# Altium schematic sheet Akustikk_forsterkerkrets.SchDoc: AAC9000
size A3; Author: Vegard Haraldstad; CompanyName: VORTEX NTNU; DrawnBy: Vegard Haraldstad; Revision: 1.0; SheetNumber: 1; SheetTotal: 1
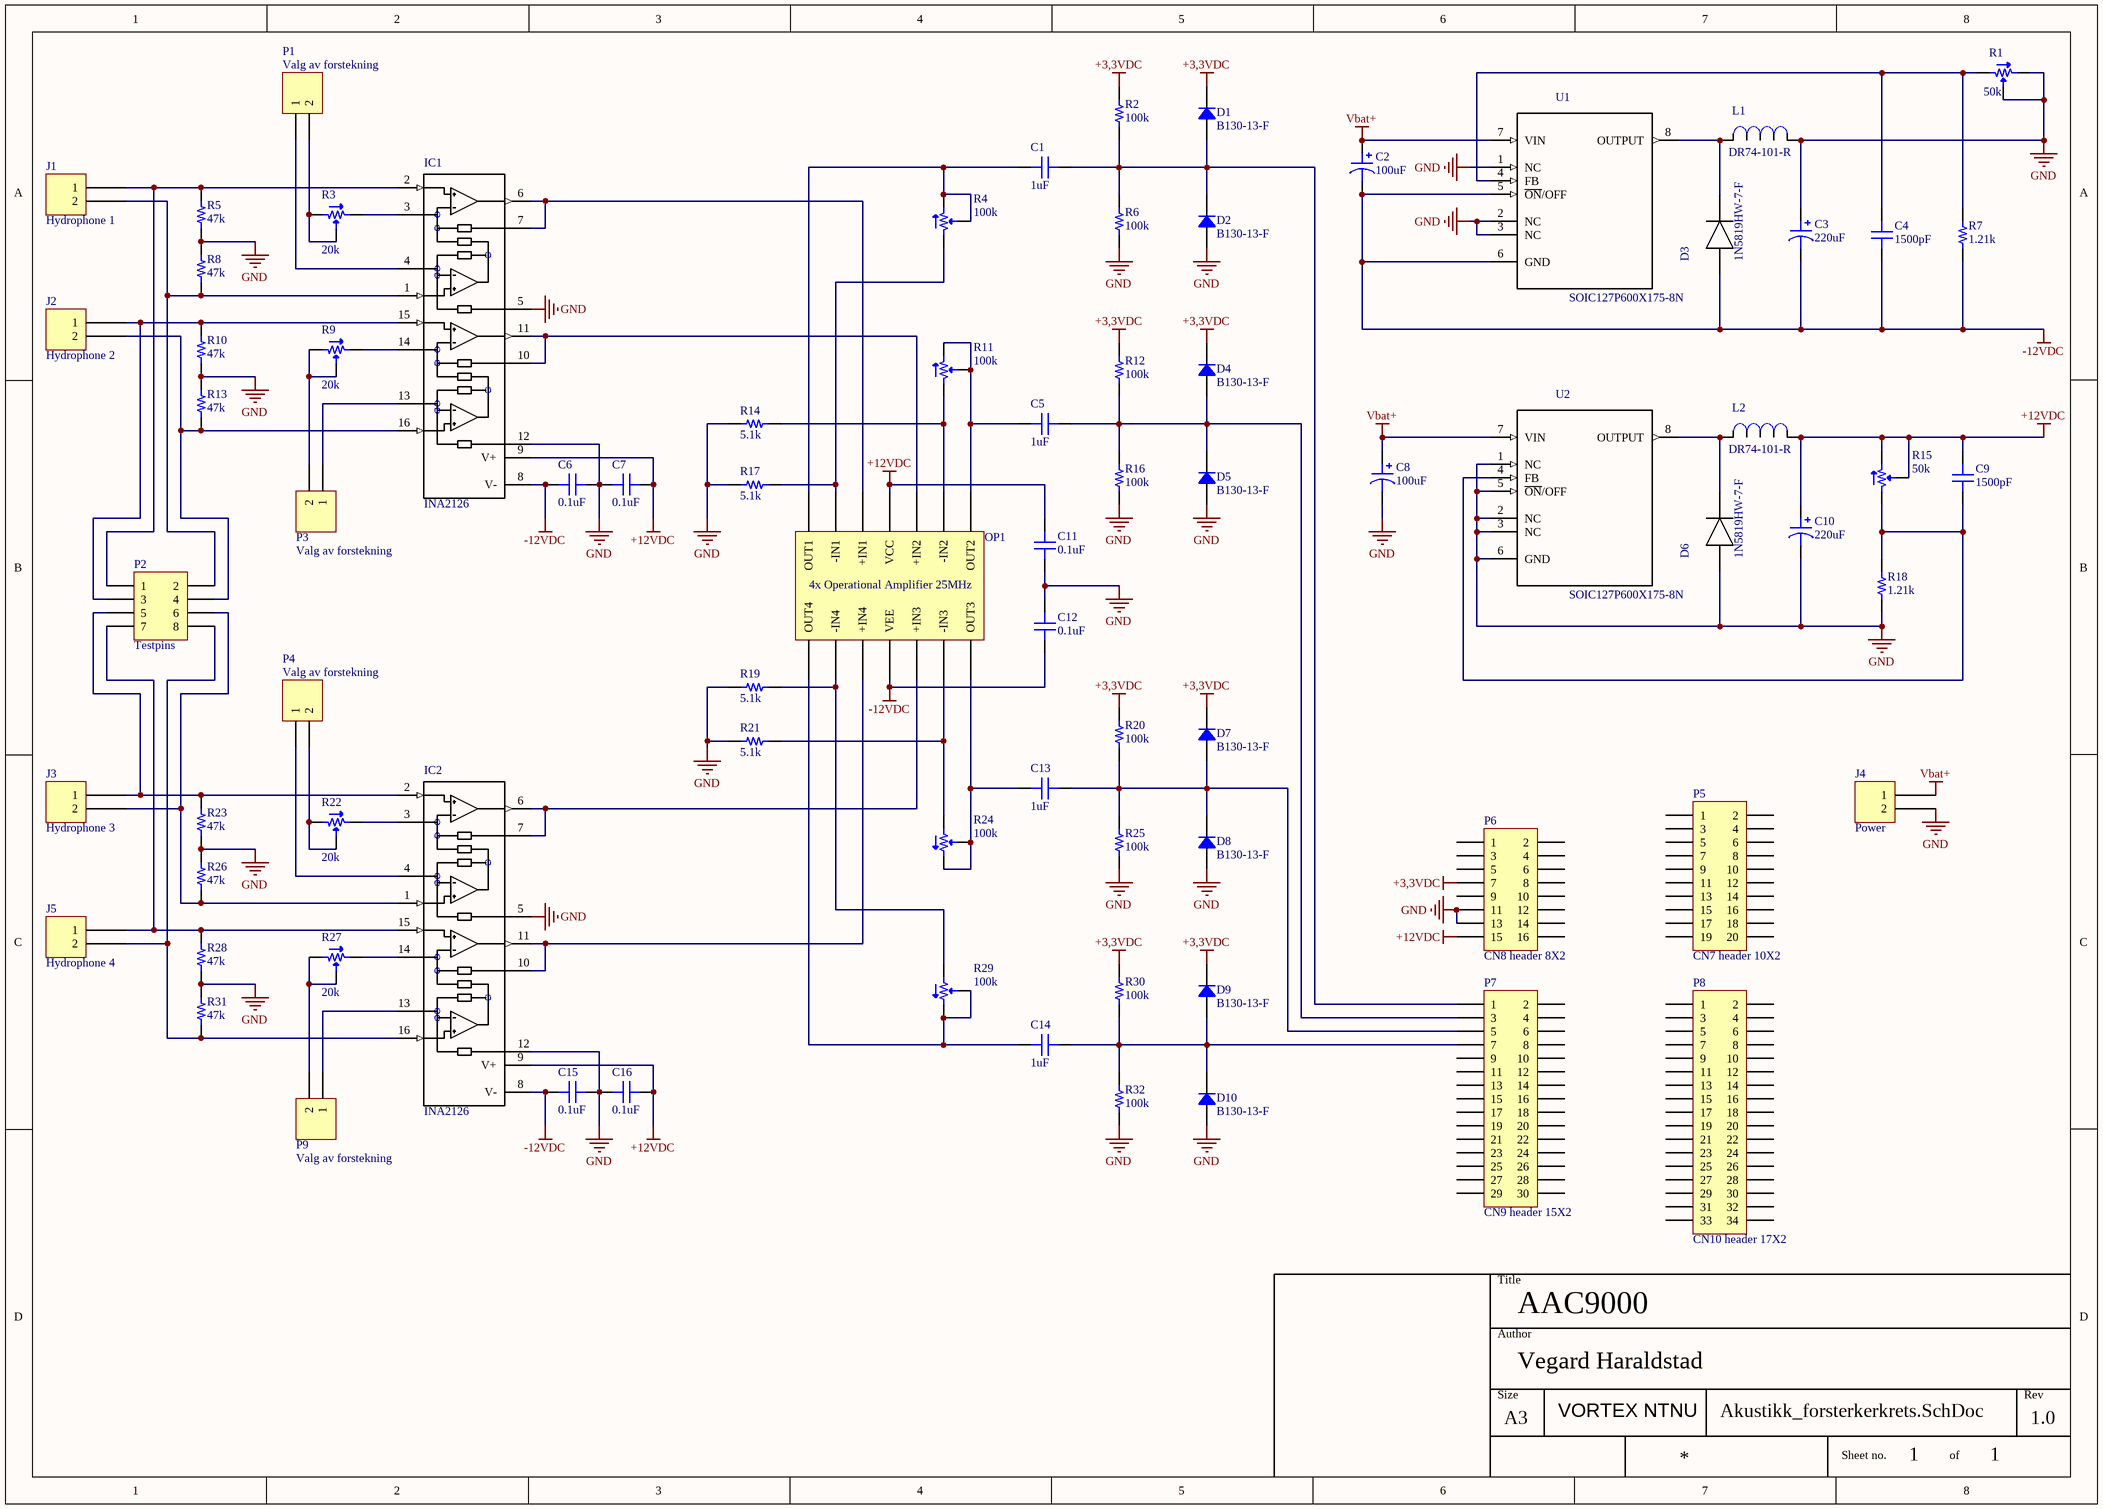
[diagram p0: Akustikk_forsterkerkrets.SchDoc]

## Parts
C1  1uF  [CAP 0805/2012]
C2  100uF  [CAP ALUM 10.3MM]
C3  220uF  [CAP ALUM 6.6MM]
C4  1500pF  [CAP 0805/2012]
C5  1uF  [CAP 0805/2012]
C6  0.1uF  [CAP 0805/2012]
C7  0.1uF  [CAP 0805/2012]
C8  100uF  [CAP ALUM 10.3MM]
C9  1500pF  [CAP 0805/2012]
C10  220uF  [CAP ALUM 6.6MM]
C11  0.1uF  [CAP 0805/2012]
C12  0.1uF  [CAP 0805/2012]
C13  1uF  [CAP 0805/2012]
C14  1uF  [CAP 0805/2012]
C15  0.1uF  [CAP 0805/2012]
C16  0.1uF  [CAP 0805/2012]
D1  B130-13-F  [DO214AC SMA]
D2  B130-13-F  [DO214AC SMA]
D3  1N5819HW-7-F  [1N5819HW-7-F]
D4  B130-13-F  [DO214AC SMA]
D5  B130-13-F  [DO214AC SMA]
D6  1N5819HW-7-F  [1N5819HW-7-F]
D7  B130-13-F  [DO214AC SMA]
D8  B130-13-F  [DO214AC SMA]
D9  B130-13-F  [DO214AC SMA]
D10  B130-13-F  [DO214AC SMA]
IC1  INA2126  [SOP63P600X175-16N]
IC2  INA2126  [SOP63P600X175-16N]
J1  Hydrophone 1  [JST XH B2B-XH-A]
J2  Hydrophone 2  [JST XH B2B-XH-A]
J3  Hydrophone 3  [JST XH B2B-XH-A]
J4  Power  [JST XH B2B-XH-A]
J5  Hydrophone 4  [JST XH B2B-XH-A]
L1  DR74-101-R  [DR74-101-R]
L2  DR74-101-R  [DR74-101-R]
OP1  4x Operational Amplifier 25MHz  [SOIC127P600X175-14N]
P1  Valg av forstekning  [HDR1X2]
P2  Testpins  [HDR2X4]
P3  Valg av forstekning  [HDR1X2]
P4  Valg av forstekning  [HDR1X2]
P5  CN7 header 10X2  [HDR2X10]
P6  CN8 header 8X2  [HDR2X8]
P7  CN9 header 15X2  [HDR2X15]
P8  CN10 header 17X2  [HDR2X17]
P9  Valg av forstekning  [HDR1X2]
R1  50k  [POT BOURNS TRIMPOT 3302]
R2  100k  [RES 0805/2012]
R3  20k  [POT BOURNS TRIMPOT 3302]
R4  100k  [POT BOURNS TRIMPOT 3302]
R5  47k  [RES 0805/2012]
R6  100k  [RES 0805/2012]
R7  1.21k  [RES 0805/2012]
R8  47k  [RES 0805/2012]
R9  20k  [POT BOURNS TRIMPOT 3302]
R10  47k  [RES 0805/2012]
R11  100k  [POT BOURNS TRIMPOT 3302]
R12  100k  [RES 0805/2012]
R13  47k  [RES 0805/2012]
R14  5.1k  [RES 0805/2012]
R15  50k  [POT BOURNS TRIMPOT 3302]
R16  100k  [RES 0805/2012]
R17  5.1k  [RES 0805/2012]
R18  1.21k  [RES 0805/2012]
R19  5.1k  [RES 0805/2012]
R20  100k  [RES 0805/2012]
R21  5.1k  [RES 0805/2012]
R22  20k  [POT BOURNS TRIMPOT 3302]
R23  47k  [RES 0805/2012]
R24  100k  [POT BOURNS TRIMPOT 3302]
R25  100k  [RES 0805/2012]
R26  47k  [RES 0805/2012]
R27  20k  [POT BOURNS TRIMPOT 3302]
R28  47k  [RES 0805/2012]
R29  100k  [POT BOURNS TRIMPOT 3302]
R30  100k  [RES 0805/2012]
R31  47k  [RES 0805/2012]
R32  100k  [RES 0805/2012]
U1  SOIC127P600X175-8N  [SOIC127P600X175-8N]
U2  SOIC127P600X175-8N  [SOIC127P600X175-8N]

## Nets
+3,3VDC: D1.2 D4.2 D7.2 D9.2 P6.7 R2.2 R12.2 R20.2 R30.2
+12VDC: C7.2 C9.2 C10.1 C11.2 C16.2 IC1.9(V+) IC2.9(V+) L2.1 OP1.4(VCC) P6.15 R15.2 R15.3
-12VDC: C2.2 C3.2 C4.1 C6.1 C12.1 C15.1 D3.2(A) IC1.8(V-) IC2.8(V-) OP1.11(VEE) R7.1 U1.5(~{ON}/OFF) U1.6(GND)
GND: C3.1 C6.2 C7.1 C8.2 C10.2 C11.1 C12.2 C15.2 C16.1 D2.1 D5.1 D6.2(A) D8.1 D10.1 IC1.5(REFA) IC1.12(REFB) IC2.5(REFA) IC2.12(REFB) J4.2 L1.1 P6.11 P6.13 R1.2 R1.3 R5.1 R6.1 R8.2 R10.1 R13.2 R14.2 R16.1 R17.2 R18.1 R19.2 R21.2 R23.1 R25.1 R26.2 R28.1 R31.2 R32.1 U1.1(NC) U1.2(NC) U1.3(NC) U2.1(NC) U2.2(NC) U2.3(NC) U2.5(~{ON}/OFF) U2.6(GND)
Vbat+: C2.1 C8.1 J4.1 U1.7(VIN) U2.7(VIN)
NetC1_1: C1.1 OP1.1(OUT1) R4.2 R4.3
NetC1_2: C1.2 D1.1 D2.2 P7.1 R2.1 R6.2
NetC4_2: C4.2 R1.1 R7.2 U1.4(FB)
NetC5_1: C5.1 OP1.7(OUT2) R11.2 R11.3
NetC5_2: C5.2 D4.1 D5.2 P7.3 R12.1 R16.2
NetC9_1: C9.1 R15.1 R18.2 U2.4(FB)
NetC13_1: C13.1 OP1.14(OUT3) R24.2 R24.3
NetC13_2: C13.2 D7.1 D8.2 P7.5 R20.1 R25.2
NetC14_1: C14.1 OP1.8(OUT4) R29.2 R29.3
NetC14_2: C14.2 D9.1 D10.2 P7.7 R30.1 R32.2
NetD3_1: D3.1(C) L1.2 U1.8(OUTPUT)
NetD6_1: D6.1(C) L2.2 U2.8(OUTPUT)
NetIC1_1: IC1.1(-INA) J1.2 P2.2 R8.1
NetIC1_2: IC1.2(+INA) J1.1 P2.1 R5.2
NetIC1_3: IC1.3(RGA) R3.3
NetIC1_4: IC1.4(RGA@1) P1.1
NetIC1_6: IC1.6(OUTA) IC1.7(SENSEA) OP1.3(+IN1)
NetIC1_10: IC1.10(SENSEB) IC1.11(OUTB) OP1.5(+IN2)
NetIC1_13: IC1.13(RGB@1) P3.1
NetIC1_14: IC1.14(RGB) R9.3
NetIC1_15: IC1.15(+INB) J2.1 P2.3 R10.2
NetIC1_16: IC1.16(-INB) J2.2 P2.4 R13.1
NetIC2_1: IC2.1(-INA) J3.2 P2.6 R26.1
NetIC2_2: IC2.2(+INA) J3.1 P2.5 R23.2
NetIC2_3: IC2.3(RGA) R22.3
NetIC2_4: IC2.4(RGA@1) P4.1
NetIC2_6: IC2.6(OUTA) IC2.7(SENSEA) OP1.12(+IN3)
NetIC2_10: IC2.10(SENSEB) IC2.11(OUTB) OP1.10(+IN4)
NetIC2_13: IC2.13(RGB@1) P9.1
NetIC2_14: IC2.14(RGB) R27.3
NetIC2_15: IC2.15(+INB) J5.1 P2.7 R28.2
NetIC2_16: IC2.16(-INB) J5.2 P2.8 R31.1
NetOP1_2: OP1.2(-IN1) R4.1 R17.1
NetOP1_6: OP1.6(-IN2) R11.1 R14.1
NetOP1_9: OP1.9(-IN4) R19.1 R29.1
NetOP1_13: OP1.13(-IN3) R21.1 R24.1
NetP1_2: P1.2 R3.1 R3.2
NetP3_2: P3.2 R9.1 R9.2
NetP4_2: P4.2 R22.1 R22.2
NetP9_2: P9.2 R27.1 R27.2

Not connected (* = marked no-connect by the designer): P5 1 2 3 4 5 6 7 8 9 10 11 12 13 14 15 16 17 18 19 20; P6 1 2 3 4 5 6 8 9 10 12 14 16; P7 2 4 6 8 9 10 11 12 13 14 15 16 17 18 19 20 21 22 23 24 25 26 27 28 29 30; P8 1 2 3 4 5 6 7 8 9 10 11 12 13 14 15 16 17 18 19 20 21 22 23 24 25 26 27 28 29 30 31 32 33 34

## Notes on the sheet
- Title
- Size
- Author
- Rev
- A3
- Sheet no.
- of

## Library data of the parts
C1 C5 C13 C14 = C0805C105J3RACTU: CAP CER 1UF 25V X7R 0805; Manufacturer: Kemet; TemperatureRange: -55C ~ 125C; Tolerance: 5%; Value: 1uF; Part Number: C0805C105J3RACTU; PartId: 6145; Supplier 1: Digi-Key; Supplier Part Number 1: 399-10060-2-ND; ComponentLink1Description: Datasheet; ComponentLink1URL: http://www.kemet.com/docfinder?Partnumber=C0805C105J3RACTU; ComponentLink2Description: Digi-Key listing; ComponentLink2URL: http://digikey.com/product-detail/en/C0805C105J3RACTU/399-10060-2-ND/2211758; TemperatureCoefficient: X7R; Voltage: 25V; Price: 0,355; Type: -; Device Package: 0805 (2012 Metric)
C2 C8 = EEE-FC1H101P: CAP ALUM 100UF 20% 50V SMD; Manufacturer: Panasonic Electronic Components; TemperatureRange: -40C ~ 105C; Type: AEC-Q200; Ripple Current: 375mA; Impedance: 300 mOhm; Lifetime @ Temp: 1000 Hrs @ 105C; Value: 100uF; Part Number: EEE-FC1H101P; PartId: 7438; Supplier 1: Digi-Key; Supplier Part Number 1: PCE4013TR-ND; ComponentLink1Description: Datasheet; ComponentLink1URL: http://industrial.panasonic.com/www-cgi/jvcr13pz.cgi?E+PZ+3+ABA0005+EEEFC1H101P+7+WW; ComponentLink2Description: Digi-Key listing; ComponentLink2URL: http://digikey.com/product-detail/en/EEE-FC1H101P/PCE4013TR-ND/817422; Tolerance: 20%; Voltage: 50V; Price: 0,4156; Device Package: Radial, Can - SMD
C3 C10 = EEE-FTE221XAP: CAP ALUM 220UF 20% 25V SMD; Manufacturer: Panasonic Electronic Components; TemperatureRange: -55C ~ 105C; Type: Automotive; Ripple Current: 390mA; Lifetime @ Temp: 2000 Hrs @ 105C; Value: 220uF; Part Number: EEE-FTE221XAP; PartId: 7275; Supplier 1: Digi-Key; Supplier Part Number 1: PCE5009TR-ND; ComponentLink1Description: Datasheet; ComponentLink1URL: http://industrial.panasonic.com/lecs/www-data/pdf/ABA0000/ABA0000CE135.pdf; ComponentLink2Description: Digi-Key listing; ComponentLink2URL: http://digikey.com/product-detail/en/EEE-FTE221XAP/PCE5009TR-ND/2652040; Tolerance: 20%; Voltage: 25V; Price: 0,3668; Device Package: Radial, Can - SMD; Impedance: -
C4 C9 = C2012C0G1H152J060AA: CAP CER 1500PF 50V C0G 0805; Manufacturer: TDK Corporation; TemperatureRange: -55C ~ 125C; TemperatureCoefficient: C0G, NP0; Tolerance: 5%; Value: 1500pF; Part Number: C2012C0G1H152J060AA; PartId: 4413; Supplier 1: Digi-Key; Supplier Part Number 1: 445-1331-2-ND; ComponentLink1Description: Datasheet; ComponentLink1URL: https://product.tdk.com/info/en/catalog/datasheets/mlcc_commercial_general_en.pdf; ComponentLink2Description: Digi-Key listing; ComponentLink2URL: http://digikey.com/product-detail/en/C2012C0G1H152J060AA/445-1331-2-ND/513857; Voltage: 50V; Price: 0,0308; Type: -; Device Package: 0805 (2012 Metric)
C6 C7 C11 C12 C15 C16 = CL21B104KACNNNC: CAP CER 0.1UF 25V X7R 0805; Manufacturer: Samsung Electro-Mechanics America, Inc.; TemperatureRange: -55C ~ 125C; Tolerance: 10%; Value: 0.1uF; Part Number: CL21B104KACNNNC; PartId: 5699; Supplier 1: Digi-Key; Supplier Part Number 1: 1276-1099-2-ND; ComponentLink1Description: Datasheet; ComponentLink1URL: http://www.samsungsem.com/kr/support/product-search/mlcc/CL21B104KACNNNC.jsp; ComponentLink2Description: Digi-Key listing; ComponentLink2URL: http://digikey.com/product-detail/en/CL21B104KACNNNC/1276-1099-2-ND/3886757; TemperatureCoefficient: X7R; Voltage: 25V; Price: 0,0099; Type: -; Device Package: 0805 (2012 Metric)
D1 D2 D4 D5 D7-D10 = B130-13-F: DIODE SCHOTTKY 30V 1A SMA; Manufacturer: Diodes Incorporated; Type: Surface Mount; Current Reverse Leakage @ Vr: 500uA @ 30V; Voltage Forward (Vf): 500mV @ 1A; Part Number: B130-13-F; PartId: 7122; Supplier 1: Digi-Key; Supplier Part Number 1: B130-FDITR-ND; ComponentLink1Description: Datasheet; ComponentLink1URL: http://www.diodes.com/_files/datasheets/ds13002.pdf; ComponentLink2Description: Digi-Key Listing; ComponentLink2URL: http://www.digikey.ca/product-detail/en/B130-13-F/B130-FDITR-ND/814935; Junction Operating Temperature: -65C ~ 150C; Price: 0,0852; Device Package: DO-214AC, SMA; Reverse Recovery Time (trr): -; Voltage DC Reverse (Vr): 30V; Current Rectified: 1A
D3 D6 = 1N5819HW-7-F: 1N5819HW Series 40 V 1 A Surface Mount Schottky Barrier Rectifier - SOD-123; MF: Diodes Inc.; SnapEDA_Link: https://www.snapeda.com/parts/1N5819HW-7-F/Diodes%20Inc./view-part/?ref=snap; Digi-Key_Part_Number: 1N5819HW-FDICT-ND; Digi-Key_Purchase_URL: https://www.digikey.no/product-detail/en/diodes-incorporated/1N5819HW-7-F/1N5819HW-FDICT-ND/815283?utm_source=snapeda&utm_medium=aggregator&utm_campaign=symbol; MP: 1N5819HW-7-F; Package: SOD-123 Diodes Inc.; Value: *; Part Number: 1N5819HW-7-F; ComponentLink1Description: Manufacturer Link; ComponentLink1URL: https://www.digikey.no/en/supplier-centers/d/diodes; ComponentLink2Description: Datasheet; ComponentLink2URL: https://www.diodes.com/assets/Datasheets/ds30217.pdf; Supplier 1: Digi-Key; Supplier Part Number 1: 1N5819HW-FDICT-ND
IC1 IC2 = INA2126EA/250: the ina126 and ina2126 are precision instrumentation amplifiers for accurate low noise differential signal acquisitio...; MF: Texas Instruments; MP: INA2126; Package: None; Availability: Unavailable; Price: None; SnapEDA_Link: https://www.snapeda.com/parts/INA2126/Texas%20Instruments/view-part/?ref=snap; Value: *; Part Number: INA2126EA/250; ComponentLink1Description: Manufacturer Link; ComponentLink1URL: http://www.ti.com/; ComponentLink2Description: Datasheet; ComponentLink2URL: http://www.ti.com/lit/ds/symlink/ina126.pdf; Supplier 1: Digi-Key; Supplier Part Number 1: INA2126EACT-ND
J1-J5 = B2B-XH-A(LF)(SN): CONN HEADER XH TOP 2POS 2.5MM; Manufacturer: JST Sales America Inc.; Pitch: 0.098" (2.50mm); Number Of Positions: 2; Part Number: B2B-XH-A(LF)(SN); Colour: Natural; PartId: 16449; Supplier 1: Digi-Key; Supplier Part Number 1: 455-2247-ND; ComponentLink1Description: Datasheet; ComponentLink1URL: http://www.jst-mfg.com/product/pdf/eng/eXH.pdf; ComponentLink2Description: Digi-Key Listing; ComponentLink2URL: http://www.digikey.com/product-detail/en/jst-sales-america-inc/B2B-XH-A(LF)(SN)/455-2247-ND/1651045; Price: 0,15; Type: Header, Shrouded; Contact Finish: Tin; Fastening Type: Detent Lock; Number Of Rows: 1; Series: XH
L1 L2 = DR74-101-R: Inductor Power Shielded Drum Core 101.6uH/100uH 20% 100KHz Ferrite 860mA 383mOhm DCR T/R; MF: Eaton; Value: 100 μH; SnapEDA_Link: https://www.snapeda.com/parts/DR74-101-R/Eaton/view-part/?ref=snap; Availability: Unavailable; MP: DR74-101-R; Price: None; Package: Nonstandard Eaton; Part Number: DR74-101-R; ComponentLink1Description: Manufacturer Link; ComponentLink1URL: https://www.digikey.no/en/supplier-centers/e/eaton; ComponentLink2Description: Datasheet; ComponentLink2URL: https://www.eaton.com/content/dam/eaton/products/electronic-components/resources/data-sheet/eaton-dr-high-power-density-high-efficiency-shielded-drum-core-power-inductors-data-sheet.pdf; Supplier 1: Digi-Key; Supplier Part Number 1: 513-1225-1-ND; Irms: 860mA
OP1 = LM837MX/NOPB: Part Number: LM837MX/NOPB; ComponentLink1Description: Manufacturer Link; ComponentLink1URL: http://www.ti.com/; ComponentLink2Description: Datasheet; ComponentLink2URL: http://www.ti.com/lit/ds/symlink/lm837.pdf; Supplier 1: Digi-Key; Supplier Part Number 1: 296-43966-1-ND
P1 P3 P4 P9 = Header 2: Header, 2-Pin; LatestRevisionDate: 17-Jul-2002; LatestRevisionNote: Re-released for DXP Platform.; Publisher: Altium Limited
P2 = Header 4X2: Header, 4-Pin, Dual row; LatestRevisionDate: 17-Jul-2002; LatestRevisionNote: Re-released for DXP Platform.; Publisher: Altium Limited
P5 = Header 10X2: Header, 10-Pin, Dual row; LatestRevisionDate: 17-Jul-2002; LatestRevisionNote: Re-released for DXP Platform.; Publisher: Altium Limited
P6 = Header 8X2: Header, 8-Pin, Dual row; LatestRevisionDate: 17-Jul-2002; LatestRevisionNote: Re-released for DXP Platform.; Publisher: Altium Limited
P7 = Header 15X2: Header, 15-Pin, Dual row; LatestRevisionDate: 17-Jul-2002; LatestRevisionNote: Re-released for DXP Platform.; Publisher: Altium Limited
P8 = Header 17X2: Header, 17-Pin, Dual row; LatestRevisionDate: 17-Jul-2002; LatestRevisionNote: Re-released for DXP Platform.; Publisher: Altium Limited
R1 R3 R4 R9 R11 R15 R22 R24 R27 R29 = 3302W-3-203E: TRIMMER 20K OHM 0.15W SMD; Manufacturer: Bourns Inc.; TemperatureCoefficient: 250ppm/C; Tolerance: 25%; Number Of Turns: 1; Adjustment Type: Top Adjustment; Part Number: 3302W-3-203E; PartId: 29442; Supplier 1: Digi-Key; Supplier Part Number 1: 3302W-203ECT-ND; ComponentLink1Description: Datasheet; ComponentLink1URL: http://www.bourns.com/docs/Product-Datasheets/3302.pdf; ComponentLink2Description: Digi-Key Listing; ComponentLink2URL: https://www.digikey.com/product-detail/en/bourns-inc/3302W-3-203E/3302W-203ECT-ND/612878; PowerRating: 0.15W; Price: 0,97
  R1 R15: Value: 50k
  R3 R9 R22 R27: Value: 20k
  R4 R11 R24 R29: Value: 100k
R2 R6 R12 R16 R20 R25 R30 R32 = ERJ-6GEYJ104V: RES SMD 100K OHM 5% 1/8W 0805; Manufacturer: Panasonic Electronic Components; TemperatureRange: -55C ~ 155C; TemperatureCoefficient: 200ppm/C; PowerRating: 0.125W, 1/8W; Value: 100k; Part Number: ERJ-6GEYJ104V; PartId: 11445; Supplier 1: Digi-Key; Supplier Part Number 1: P100KATR-ND; ComponentLink1Description: Datasheet; ComponentLink1URL: http://industrial.panasonic.com/www-cgi/jvcr13pz.cgi?E+PZ+3+AOA0001+ERJ6GEYJ104V+7+WW; ComponentLink2Description: Digi-Key Listing; ComponentLink2URL: https://www.digikey.com/product-detail/en/panasonic-electronic-components/ERJ-6GEYJ104V/P100KATR-ND/83110; Tolerance: 5%; Price: 0,0032; Device Package: 0805 (2012 Metric)
R5 R8 R10 R13 R23 R26 R28 R31 = ERJ-6ENF4702V: RES SMD 47K OHM 1% 1/8W 0805; Manufacturer: Panasonic Electronic Components; TemperatureRange: -55C ~ 155C; TemperatureCoefficient: 100ppm/C; PowerRating: 0.125W, 1/8W; Value: 47k; Part Number: ERJ-6ENF4702V; PartId: 1984; Supplier 1: Digi-Key; Supplier Part Number 1: P47.0KCTR-ND; ComponentLink1Description: Datasheet; ComponentLink1URL: http://industrial.panasonic.com/www-cgi/jvcr13pz.cgi?E+PZ+3+AOA0002+ERJ6ENF4702V+7+WW; ComponentLink2Description: Digi-Key listing; ComponentLink2URL: http://digikey.com/product-detail/en/ERJ-6ENF4702V/P47.0KCTR-ND/1746509; Tolerance: 1%; Price: 0,0073; Type: Thick Film; Device Package: 0805 (2012 Metric)
R7 R18 = ERA-6AEB1211V: RES SMD 1.21K OHM 0.1% 1/8W 0805; Manufacturer: Panasonic Electronic Components; TemperatureRange: -55C ~ 155C; TemperatureCoefficient: 25ppm/C; PowerRating: 0.125W, 1/8W; Value: 1.21k; Part Number: ERA-6AEB1211V; PartId: 2672; Supplier 1: Digi-Key; Supplier Part Number 1: P1.21KDATR-ND; ComponentLink1Description: Datasheet; ComponentLink1URL: http://industrial.panasonic.com/lecs/www-data/pdf/AOA0000/AOA0000CE26.pdf; ComponentLink2Description: Digi-Key listing; ComponentLink2URL: http://digikey.com/product-detail/en/ERA-6AEB1211V/P1.21KDATR-ND/2025670; Tolerance: 0.1%; Price: 0,0653; Type: Thin Film; Device Package: 0805 (2012 Metric)
R14 R17 R19 R21 = ERJ-6ENF5101V: RES SMD 5.1K OHM 1% 1/8W 0805; Manufacturer: Panasonic Electronic Components; TemperatureRange: -55C ~ 155C; TemperatureCoefficient: 100ppm/C; PowerRating: 0.125W, 1/8W; Value: 5.1k; Part Number: ERJ-6ENF5101V; PartId: 2010; Supplier 1: Digi-Key; Supplier Part Number 1: P5.10KCTR-ND; ComponentLink1Description: Datasheet; ComponentLink1URL: http://industrial.panasonic.com/www-cgi/jvcr13pz.cgi?E+PZ+3+AOA0002+ERJ6ENF5101V+7+WW; ComponentLink2Description: Digi-Key listing; ComponentLink2URL: http://digikey.com/product-detail/en/ERJ-6ENF5101V/P5.10KCTR-ND/1746513; Tolerance: 1%; Price: 0,0073; Type: Thick Film; Device Package: 0805 (2012 Metric)
U1 U2 = SOIC127P600X175-8N: SIMPLE SWITCHERÂ® 40V, 500mA Low Component Count Step-Down Regulator 8-SOIC -40 to 125; MP: LM2674MX-12/NOPB; MF: Texas Instruments; Vin,min: 4.5V; Vout,min: 1.23V; Vout,max: 37V; SnapEDA_Link: https://www.snapeda.com/parts/LM2674MX-12/NOPB/Texas%20Instruments/view-part/?ref=snap; Availability: Unavailable; Package: SOIC-8 Texas Instruments; Price: None; Value: *; Part Number: SOIC127P600X175-8N; ComponentLink1Description: Manufacturer Link; ComponentLink1URL: https://www.digikey.com/en/supplier-centers/o/on-semiconductor; ComponentLink2Description: Datasheet; ComponentLink2URL: ww.onsemi.com/pub/Collateral/LM2594-D.PDF; Supplier 1: Digi-Key; Supplier Part Number 1: LM2594DADJR2GOSCT-ND; Vin,max: 40V; Iout,max: 500mA